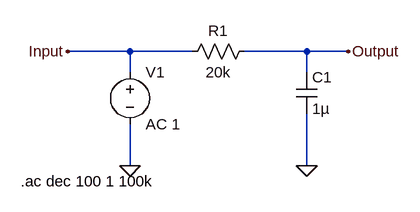
[diagram p0: schematic Filtro_pasabajo.asc]
Filtro_pasabajo.asc, the LTspice schematic file:
Version 4
SHEET 1 880 680
WIRE 112 96 16 96
WIRE 208 96 112 96
WIRE 384 96 288 96
WIRE 448 96 384 96
WIRE 112 128 112 96
WIRE 384 128 384 96
WIRE 112 272 112 208
WIRE 384 272 384 192
FLAG 112 272 0
FLAG 384 272 0
FLAG 16 96 Input
FLAG 448 96 Output
SYMBOL voltage 112 112 R0
SYMATTR InstName V1
SYMATTR Value AC 1
SYMBOL res 304 80 R90
WINDOW 0 0 56 VBottom 2
WINDOW 3 32 56 VTop 2
SYMATTR InstName R1
SYMATTR Value 20k
SYMBOL cap 368 128 R0
SYMATTR InstName C1
SYMATTR Value 1µ
TEXT -56 296 Left 2 !.ac dec 100 1 100k

The netlist it stands for:
* Filtro_pasabajo.asc
V1 Input 0 AC 1
R1 Output Input 20k
C1 Output 0 1µ
.ac dec 100 1 100k
.backanno
.end